# Altium project Encoder.PrjPcb
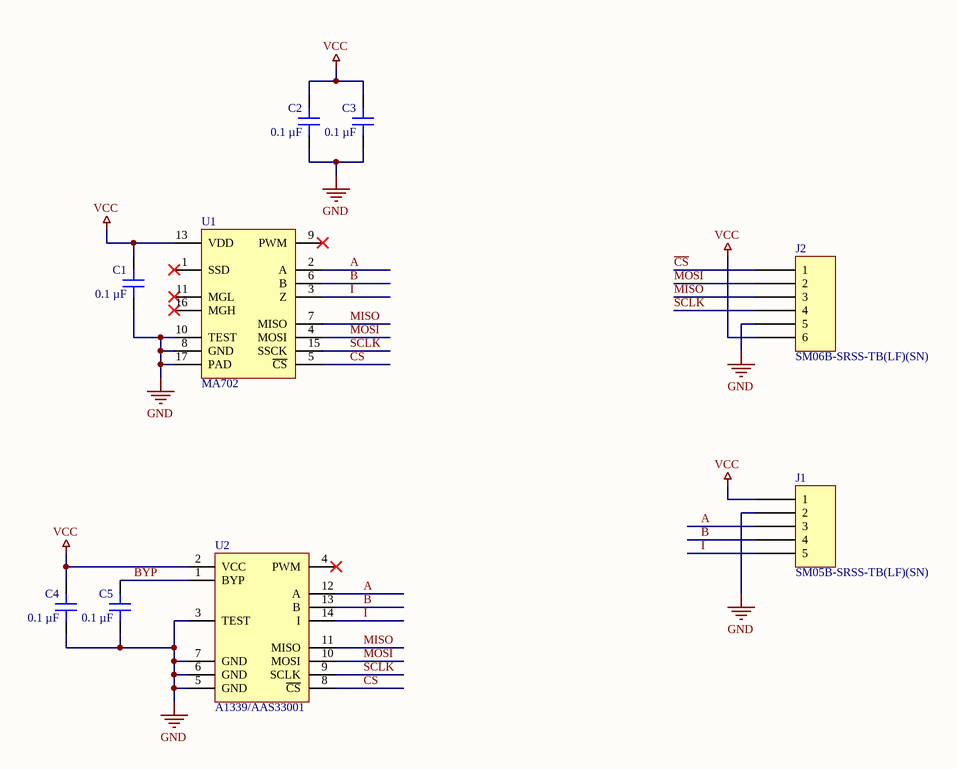
[diagram p0: Top.SchDoc]
ProjectRevision: 1.1
1 sheet, 9 parts. Net scope: global (net labels, ports and power ports of the same name join across sheets).
Board file: Encode.PcbDoc

## Sheet Top.SchDoc
size B; DocumentNumber: 1; SheetNumber: 1; SheetTotal: 1

### Parts
C1  0.1 µF  [CAP 0402_1005]
C2  0.1 µF  [CAP 0402_1005]
C3  0.1 µF  [CAP 0402_1005]
C4  0.1 µF  [CAP 0402_1005]
C5  0.1 µF  [CAP 0402_1005]
J1  SM05B-SRSS-TB(LF)(SN)  [JST SM05B-SRSS-TB]
J2  SM06B-SRSS-TB(LF)(SN)  [JST SM06B-SRSS-TB]
U1  MA702  [IC_MA702GQ-Z]
U2  A1339/AAS33001  [TSSOP14]

### Nets
GND: C1.2 C2.2 C3.2 C4.2 C5.2 J1.2 J2.5 U1.8(GND) U1.10(TEST) U1.17(PAD) U2.3(TEST) U2.5(GND) U2.6(GND) U2.7(GND)
VCC: C1.1 C2.1 C3.1 C4.1 J1.1 J2.6 U1.13(VDD) U2.2(VCC)
A: J1.3 U1.2(A) U2.12(A)
B: J1.4 U1.6(B) U2.13(B)
BYP: C5.1 U2.1(BYP)
~{CS}: J2.1 U1.5(~{CS}) U2.8(~{CS})
I: J1.5 U1.3(Z) U2.14(I)
MISO: J2.3 U1.7(MISO) U2.11(MISO)
MOSI: J2.2 U1.4(MOSI) U2.10(MOSI)
SCLK: J2.4 U1.15(SSCK) U2.9(SCLK)

Not connected (* = marked no-connect by the designer): U1 1(SSD)* 9(PWM)* 11(MGL)* 16(MGH)*; U2 4(PWM)*

### Library data of the parts
C1-C5 = C0402C104K3RAC7867: CAP CER 0.1UF 25V X7R 0402; manufacturer: KEMET; Tolerance: ±10%; Part Number: C0402C104K3RAC7867; Value: 0.1 µF; Applications: Bypass, Decoupling; Capacitance: 0.1 µF; componentlink1description: Datasheet; componentlink1url: https://api.kemet.com/component-edge/download/datasheet/C0402C104K3RAC7867.pdf; componentlink2description: DigiKey Link; componentlink2url: https://www.digikey.com/en/products/detail/kemet/C0402C104K3RAC7867/6697176; Device Package: 0402 (1005 Metric); lastupdated: 2/9/2024 8:04:32 PM; Lifecycle Status: Active; Minimum Order: 1; Mounting Type: Surface Mount, MLCC; Operating Temperature: -55°C ~ 125°C; Package / Case: 0402 (1005 Metric); packaging: TapeAndReel; partid: 39011; Part Status: Active; price: 0.02; series: SMD Comm X7R; Size / Dimension: 0.039" L x 0.020" W (1.00mm x 0.50mm); Supplier 1: DigiKey; Supplier Part Number 1: 399-14148-1-ND; Temperature Coefficient: X7R; Thickness (Max): 0.022" (0.55mm); Voltage - Rated: 25V
J1 = SM05B-SRSS-TB(LF)(SN): CONN HEADER SMD R/A 5POS 1MM; Manufacturer: JST Sales America Inc.; Current Rating (Amps): 0.7A; Material Flammability Rating: UL94 V-0; Number of Positions: 5; Number of Positions Loaded: All; Pitch - Mating: 0.039" (1.00mm); Shrouding: Shrouded - 4 Wall; Style: Board to Cable/Wire; Voltage Rating: 50V; Part Number: SM05B-SRSS-TB(LF)(SN); ComponentLink1Description: Datasheet; ComponentLink1URL: http://www.jst-mfg.com/product/pdf/eng/eSH.pdf; ComponentLink2Description: DigiKey Link; ComponentLink2URL: http://digikey.com/product-detail/en/jst-sales-america-inc/SM05B-SRSS-TB-LF-SN/455-1805-1-ND/926876; Connector Type: Header; Contact Finish - Mating: Tin; Contact Finish - Post: Tin; Contact Material: Copper Alloy; Contact Shape: Square; Contact Type: Male Pin; Fastening Type: Push-Pull; Features: Solder Retention; Insulation Color: Natural; Insulation Height: 0.114" (2.90mm); Insulation Material: Polyamide (PA), Nylon; LastUpdated: 1/12/2020 11:42:04 PM; Lifecycle Status: Active; Minimum Order: 1; Mounting Type: Surface Mount, Right Angle; Number of Rows: 1; Operating Temperature: -25°C ~ 85°C; Packaging: TapeAndReel; PartId: 63; Part Status: Active; Price: 0.32; Series: SR; Supplier 1: DigiKey; Supplier Part Number 1: 455-1805-1-ND; Termination: Solder
J2 = SM06B-SRSS-TB(LF)(SN): CONN HEADER SMD R/A 6POS 1MM; Manufacturer: JST Sales America Inc.; Current Rating (Amps): 0.7A; Material Flammability Rating: UL94 V-0; Number of Positions: 6; Number of Positions Loaded: All; Pitch - Mating: 0.039" (1.00mm); Shrouding: Shrouded - 4 Wall; Style: Board to Cable/Wire; Voltage Rating: 50V; Part Number: SM06B-SRSS-TB(LF)(SN); ComponentLink1Description: Datasheet; ComponentLink1URL: http://www.jst-mfg.com/product/pdf/eng/eSH.pdf; ComponentLink2Description: DigiKey Link; ComponentLink2URL: http://digikey.com/product-detail/en/jst-sales-america-inc/SM06B-SRSS-TB-LF-SN/455-1806-1-ND/926877; Connector Type: Header; Contact Finish - Mating: Tin; Contact Finish - Post: Tin; Contact Material: Copper Alloy; Contact Shape: Square; Contact Type: Male Pin; Fastening Type: Push-Pull; Features: Solder Retention; Insulation Color: Natural; Insulation Height: 0.114" (2.90mm); Insulation Material: Polyamide (PA), Nylon; LastUpdated: 1/12/2020 11:42:14 PM; Lifecycle Status: Active; Minimum Order: 1; Mounting Type: Surface Mount, Right Angle; Number of Rows: 1; Operating Temperature: -25°C ~ 85°C; Packaging: TapeAndReel; PartId: 64; Part Status: Active; Price: 0.36; Series: SR; Supplier 1: DigiKey; Supplier Part Number 1: 455-1806-1-ND; Termination: Solder
U1 = MA702: Hall effect encoder

## Assembly variants
Main: not fitted U2